# Altium schematic sheet DigitalInput.SchDoc: Title
size 396 x 279 mm; PageSetup: Record=PageOptions|CenterHorizontal=True|CenterVertical=True|PrintScale=1.00|XCorrection=1.00|YCorrection=1.00|PrintKind=0|BorderSize=5000000|LeftOffset=0|BottomOffset=0|Orientation=2|PaperLength=1000|PaperWidth=1000|Scale=100|PaperSource=7|PrintQuality=-4|MediaType=1|DitherType=10|PaperKind=A3|PrintScaleMode=0
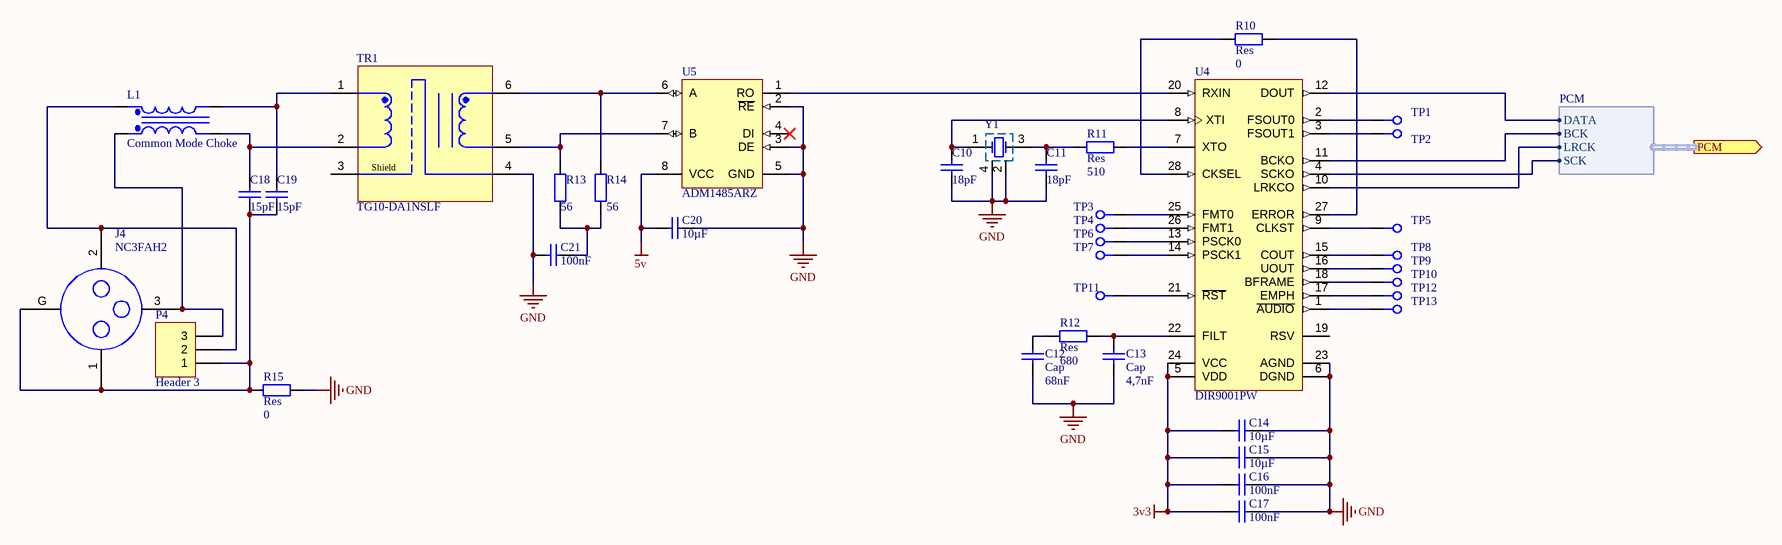
[diagram p0: DigitalInput.SchDoc]

## Parts
C10  value 18pF  [CAPC1005X56X25NL10T15]  (hidden comment: Cap)
C11  value 18pF  [CAPC1005X56X25NL10T15]  (hidden comment: Cap)
C12  Cap  value 68nF  [CAPC1005X56X25ML10T15]
C13  Cap  value 4,7nF  [CAPC1005X56X25LL10T15]
C14  value 10µF  [CAPC2013X140X50LL20T25]  (hidden comment: Cap)
C15  value 10µF  [CAPC2013X140X50LL20T25]  (hidden comment: Cap)
C16  value 100nF  [CAPC1005X56X25NL10T15]  (hidden comment: Cap)
C17  value 100nF  [CAPC1005X56X25NL10T15]  (hidden comment: Cap)
C18  value 15pF  [CAPC1005X56X25NL10T15]  (hidden comment: Cap)
C19  value 15pF  [CAPC1005X56X25NL10T15]  (hidden comment: Cap)
C20  value 10µF  [CAPC2013X140X50LL20T25]  (hidden comment: Cap)
C21  value 100nF  [CAPC1608X90X35ML15T15]  (hidden comment: Cap)
J4  NC3FAH2  [NC3FAH2]
L1  Common Mode Choke  [WE-CNSW-1206]
P4  Header 3  [MTA-100-3P]
R10  Res  value 0  [RESC1005X40X25NL05T05]
R11  Res  value 510  [RESC1005X40X25NL05T05]
R12  Res  value 680  [RESC1005X40X25NL05T05]
R13  value 56  [RESC1609X50X30ML10T20]  (hidden comment: Res)
R14  value 56  [RESC1609X50X30ML10T20]  (hidden comment: Res)
R15  Res  value 0  [RESC3216X60X45LL10T20]
TP1  TP Ø1.27MM  [TP_1.27MM]  (value not drawn)  (no BOM)
TP2  TP Ø1.27MM  [TP_1.27MM]  (value not drawn)  (no BOM)
TP3  TP Ø1.27MM  [TP_1.27MM]  (value not drawn)  (no BOM)
TP4  TP Ø1.27MM  [TP_1.27MM]  (value not drawn)  (no BOM)
TP5  TP Ø1.27MM  [TP_1.27MM]  (value not drawn)  (no BOM)
TP6  TP Ø1.27MM  [TP_1.27MM]  (value not drawn)  (no BOM)
TP7  TP Ø1.27MM  [TP_1.27MM]  (value not drawn)  (no BOM)
TP8  TP Ø1.27MM  [TP_1.27MM]  (value not drawn)  (no BOM)
TP9  TP Ø1.27MM  [TP_1.27MM]  (value not drawn)  (no BOM)
TP10  TP Ø1.27MM  [TP_1.27MM]  (value not drawn)  (no BOM)
TP11  TP Ø1.27MM  [TP_1.27MM]  (value not drawn)  (no BOM)
TP12  TP Ø1.27MM  [TP_1.27MM]  (value not drawn)  (no BOM)
TP13  TP Ø1.27MM  [TP_1.27MM]  (value not drawn)  (no BOM)
TR1  TG10-DA1NSLF  [TG10-DA1NSLF-Footprint-1]
U4  DIR9001PW  [PW0028A_N]
U5  ADM1485ARZ  [ADI-R-8_M]
Y1  Crystal4  [XTAL-5x3.2MM]  (value not drawn)

## Ports
PCM (out, harness PCM)

## Harnesses
PCM: DATA, BCK, LRCK, SCK

## Nets
3v3: C14.2 C15.2 C16.1 C17.1 U4.5(VDD) U4.24(VCC)
5v: C20.2 U5.8(VCC)
GND: C10.1 C11.1 C12.1 C13.1 C14.1 C15.1 C16.2 C17.2 C20.1 C21.1 R15.1 TR1.4 U4.6(DGND) U4.23(AGND) U5.2(~{RE}) U5.3(DE) U5.5(GND) Y1.2(GND) Y1.4
NetC10_2: C10.2 U4.8(XTI) Y1.1(OSC1)
NetC11_2: C11.2 R11.1 Y1.3(OSC2)
NetC12_2: C12.2 R12.1
NetC13_2: C13.2 R12.2 U4.22(FILT)
NetC18_1: C18.1 C19.1 J4.1 J4.G P4.1 R15.2
NetC18_2: C18.2 L1.4 TR1.2
NetC19_2: C19.2 L1.3 TR1.1
NetC21_2: C21.2 R13.1 R14.1
NetJ4_2: J4.2 L1.2 P4.2
NetJ4_3: J4.3 L1.1 P4.3
NetR10_1: R10.1 U4.28(CKSEL)
NetR10_2: R10.2 U4.27(ERROR)
NetR11_2: R11.2 U4.7(XTO)
NetR13_2: R13.2 TR1.5 U5.7(B)
NetR14_2: R14.2 TR1.6 U5.6(A)
NetTP1_1: TP1.1 U4.2(FSOUT0)
NetTP2_1: TP2.1 U4.3(FSOUT1)
NetTP3_1: TP3.1 U4.25(FMT0)
NetTP4_1: TP4.1 U4.26(FMT1)
NetTP5_1: TP5.1 U4.9(CLKST)
NetTP6_1: TP6.1 U4.13(PSCK0)
NetTP7_1: TP7.1 U4.14(PSCK1)
NetTP8_1: TP8.1 U4.15(COUT)
NetTP9_1: TP9.1 U4.16(UOUT)
NetTP10_1: TP10.1 U4.18(BFRAME)
NetTP11_1: TP11.1 U4.21(~{RST})
NetTP12_1: TP12.1 U4.17(EMPH)
NetTP13_1: TP13.1 U4.1(~{AUDIO})
NetU4_4: U4.4(SCKO) ; port PCM.SCK
NetU4_10: U4.10(LRKCO) ; port PCM.LRCK
NetU4_11: U4.11(BCKO) ; port PCM.BCK
NetU4_12: U4.12(DOUT) ; port PCM.DATA
NetU4_20: U4.20(RXIN) U5.1(RO)

Not connected (* = marked no-connect by the designer): TR1 3; U4 19(RSV); U5 4(DI)*

## Notes on the sheet
- A
- B
- C
- D
- E
- F
- 1
- 2
- 3
- ZENITEL reserves the right to
- In the interest of product improvement,
- to a third person without our written consent.
- and must not be copied or shown
- This document is property of ZENITEL
- 4
- TITLE:
- REV No.
- ISSUE DATE
- REASON FOR ISSUE
- PREPARED
- CHECKED
- APPROVED
- DOC No:
- -CD
- alter specification and design without notice.
- PAGE No:
- of
- PAGE:
- FILE:
- (in symbol CMP-TR-00015-1) Shield

## Library data of the parts
C10 C11 = CMP-CAP-00019-3: Chip cap 18p 50V - 0402; Zenitel PartNumber: 4000080916; Capacitor Type: Ceramic; Tolerance: 5%; Dielectric: NP0; Mount: SMD; RoHS: Yes; Case/Package: 0402; Pins: 2; Voltage: 50V
C12 = CMP-CAP-00050-3: Chip cap 68n 10V - 0402; Zenitel PartNumber: 4000080947; Dielectric: X5R; Capacitor Type: Ceramic; Tolerance: 100%; Voltage: 10V; Pins: 2; Case/Package: 0402; RoHS: Yes; Mount: SMD
C13 = CMP-CAP-00043-3: Chip cap 4700p 50V - 0402; Zenitel PartNumber: 4000080940; Capacitor Type: Ceramic; Tolerance: 100%; Dielectric: -; Voltage: 50V; Pins: 2; Mount: SMD; Case/Package: 0402; RoHS: Yes
C14 C15 C20 = CMP-CAP-00199-3: CR0805 10u 10V X7R 10% h=1.25mm; Zenitel PartNumber: 4000060821; Capacitor Type: Ceramic; Tolerance: 10%; Case/Package: 0805; Mount: SMD; Dielectric: X7R; Voltage: 10V
C16 C17 = CMP-CAP-00051-3: Chip cap  100n 10V - 0402  X7R; Zenitel PartNumber: 4000080948; Tolerance: 10%; Capacitor Type: Ceramic; Pins: 2; RoHS: Yes; Mount: SMD; Dielectric: X7R; Voltage: 10V; Case/Package: 0402
C18 C19 = CMP-CAP-00859-2: Chip cap 15pF 50V NP0 - 0402; Zenitel PartNumber: EFSMD17120; Capacitor Type: Ceramic; Tolerance: 1%; Mount: SMT; RoHS: Yes; Dielectric: NP0; Pins: 2; Case/Package: 0402; Voltage: 50V
C21 = CMP-CAP-00096-3: Chip cap  100n 50V X7R - 0603; Zenitel PartNumber: 4000084734; Tolerance: 10%; Capacitor Type: Ceramic; Mount: SMD; Dielectric: X7R; Case/Package: 0603; Voltage: 50V
J4 = CMP-CON-00344-1: NC3FAH2 3pole female XLR 90deg; Zenitel PartNumber: 4000083398; Mount: HOLE
L1 = CMP-IND-00356-1: WE-CNSW SMD Common Mode Line Filter; Zenitel PartNumber: 4000086128; Current: 230mA; Type: Coil; Mount: SMD
P4 = CMP-CON-00453-1: MTA-100-3P 3-pin header; Zenitel PartNumber: 4000085467; Rows: 1; Angle: Straight; Pitch: 2.54mm; Type: MTA header; Series: MTA; Pins: 3
R10 = CMP-RES-00006-3: Chip resistor 0R - 0402; Zenitel PartNumber: 4000081051; Power: 62,5mW; Tolerance: 1%; Voltage: 50V; Case/Package: 0402
R11 = CMP-RES-00087-3: Chip resistor 0402 - 510R 1%; Zenitel PartNumber: 4000088250; Power: 62,5mW; Voltage: 50V; Case/Package: 0402; Tolerance: 1%
R12 = CMP-RES-00041-3: Chip resistor 680R - 0402; Zenitel PartNumber: 4000081086; Power: 62,5mW; Tolerance: 1%; Voltage: 50V; Case/Package: 0402
R13 R14 = CMP-RES-00152-3: CR 0603 56R 5%; Zenitel PartNumber: 4000098393; Power: 100mW; Mount: SMD; Case/Package: 0603; Tolerance: 5%
R15 = CMP-RES-00440-3: 0R 1206; Zenitel PartNumber: 4000085059; Power: 250mW; Tolerance: 0%; Case/Package: 1206; Mount: SMD
TP1-TP13 = CMP-ELMEC-00017-2: Test Point, copper pad, 1.27mm diameter; Type: TP; Mount: SMD; Case/Package: Ø1.27mm; RoHS: Yes
TR1 = CMP-TR-00015-1: Audio Transformers / Signal Transformers ISO MOD GullWng Sgl Audio w/ shield 6pin; Type: Digital audio; Ratio: 1:1; Pins: 6; Mount: SMD; RoHS: Yes
U4 = CMP-0312-00068-2: 96 kHz Digital Audio Receiver, 50 ps Jitter, 3.3V, -40 to 85 degC, 28-Pin TSSOP (PW), Green (RoHS & no Sb/Br); Manufacturer: Texas Instruments; Supply Voltage(s)(V): 3.3; Jitter(ps): 50; Sampling Rate(Max)(kHz): 108; PackageVersion: revG, Feb-2011; ComponentLink2URL: http://www.ti.com/litv/pdf/mpds364; ComponentLink2Description: Package Specification; Code_JEDEC: MO-153; ComponentLink1Description: Datasheet; PackageReference: PW0028A; SubFamily: Digital Audio Receiver; PartNumber: DIR9001PW; ComponentLink1URL: http://www.ti.com/general/docs/lit/getliterature.tsp?genericPartNumber=DIR9001&fileType=pdf; Eco-Plan: Green (RoHS & no Sb/Br); PackageDescription: 28-Pin Plastic Thin Small Outline Package 9.7 x 4.4 mm Body ,0.65 mm Pitch; DatasheetVersion: SLES198; Mounting Technology: Surface Mount
U5 = CMP-0535-00061-1: Manufacturer: Analog Devices; Duplex: Half; Supply Voltage: 5; Number of Drivers: 1; Guaranteed Data Rate: 30 Mbps; Receiver Hysteresis: 50 mV; Packing: Tube; RoHS: TRUE; ComponentLink2Description: Datasheet; PackageDescription: 8-Pin Standard Small Outline Package, Body 4.9 x 3.9 mm, Pitch 1.27 mm; Mounting Technology: Surface Mount; ComponentLink1Description: Manufacturer URL; ComponentLink3Description: Package Specification; PartNumber: ADM1485ARZ; PackageVersion: 06/2006; Temperature Range: -40 to 85 degC; DatasheetVersion: Rev. E
Y1 = CMP-XTAL-00115-1: Crystal 24.576MHZ 18pF 5X3.2mm; Zenitel PartNumber: 4000086516; Frequency: 24,576MHz; Mount: HOLE; Type: Crystal